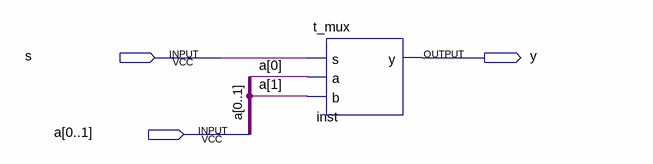
[diagram p0: schematic sheet]
// Quartus schematic t_mux_m.bdf as structural Verilog: 1 symbols, 3 pins
module t_mux_m (
  input  s,
  input  [0:1] a,
  output y
);

  t_mux inst (.s(s), .a(a[0]), .b(a[1]), .y(y));
endmodule
